# Altium schematic sheet FPOSINDC3.SchDoc
size A3; PageSetup: Record=PageOptions|CenterHorizontal=True|CenterVertical=True|PrintScale=0.73|XCorrection=1.00|YCorrection=1.00|PrintKind=1|BorderSize=5000000|LeftOffset=0|BottomOffset=0|Orientation=2|PaperLength=2970|PaperWidth=2100|Scale=100|PaperSource=256|PrintQuality=600|MediaType=0|DitherType=0|PaperKind=A4|PrintScaleMode=1
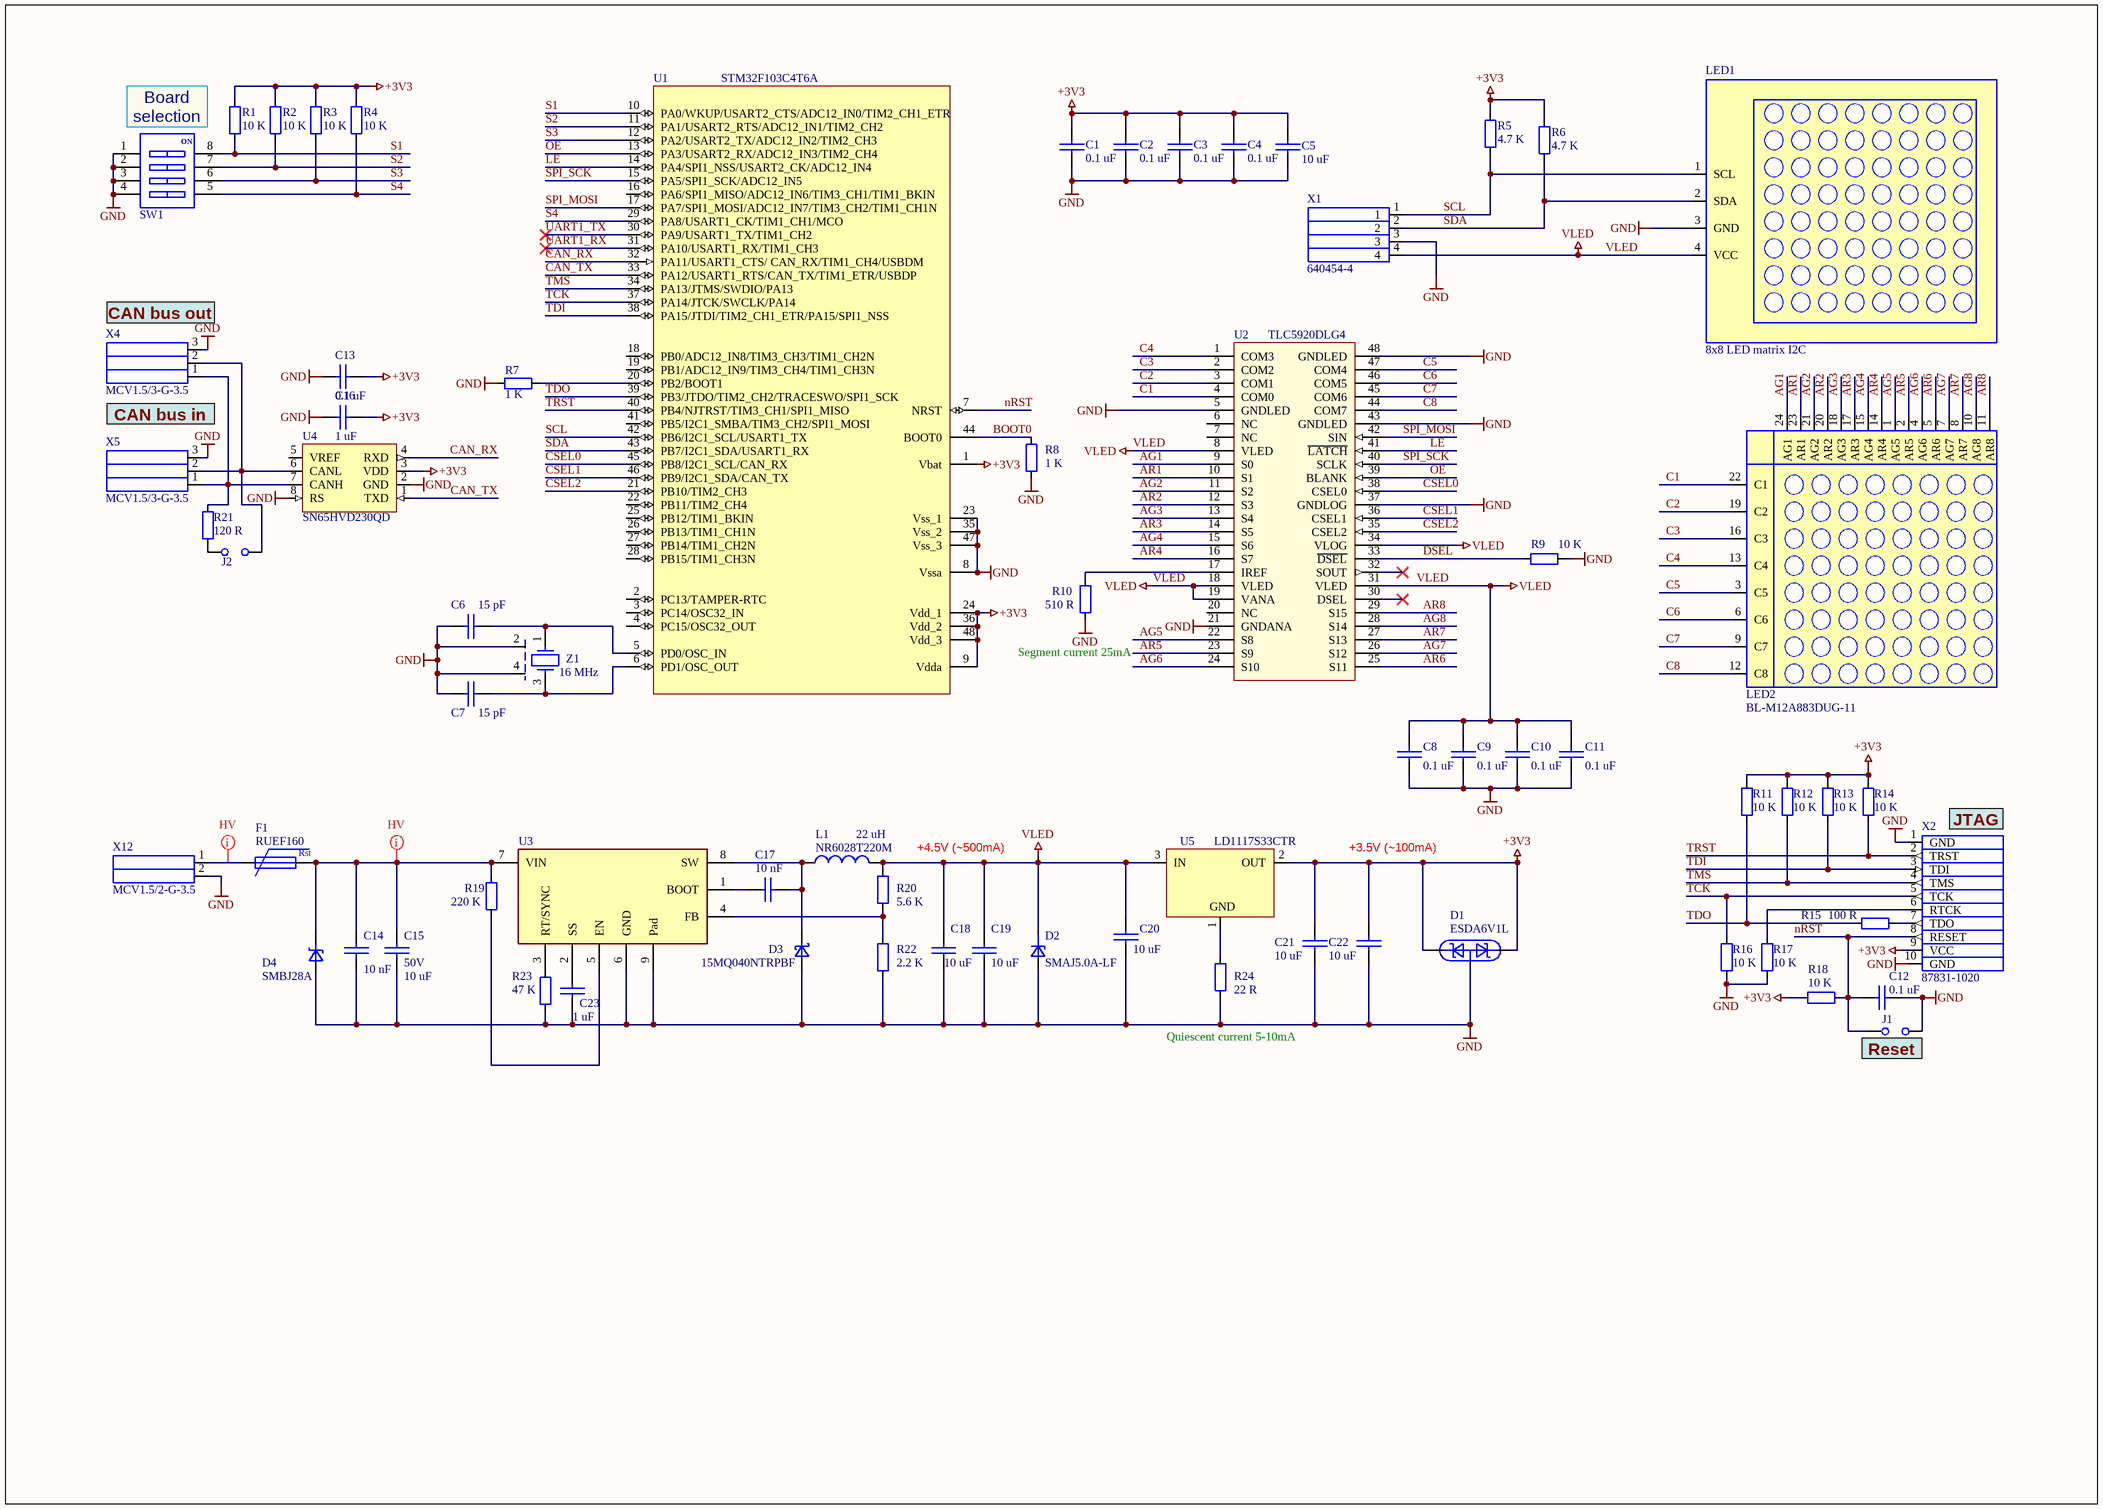
[diagram p0: FPOSINDC3.SchDoc]

## Parts
C1  value 0.1 uF  [1608[0603]]  (hidden comment: 0603B104K500CT)
C2  value 0.1 uF  [1608[0603]]  (hidden comment: 0603B104K500CT)
C3  value 0.1 uF  [1608[0603]]  (hidden comment: 0603B104K500CT)
C4  value 0.1 uF  [1608[0603]]  (hidden comment: 0603B104K500CT)
C5  value 10 uF  [2012[0805]]  (hidden comment: 08053D106KAT2A)
C6  value 15 pF  [1608[0603]]  (hidden comment: CCPF015K0603)
C7  value 15 pF  [1608[0603]]  (hidden comment: CCPF015K0603)
C8  value 0.1 uF  [1608[0603]]  (hidden comment: 0603B104K500CT)
C9  value 0.1 uF  [1608[0603]]  (hidden comment: 0603B104K500CT)
C10  value 0.1 uF  [1608[0603]]  (hidden comment: 0603B104K500CT)
C11  value 0.1 uF  [1608[0603]]  (hidden comment: 0603B104K500CT)
C12  value 0.1 uF  [1608[0603]]  (hidden comment: 0603B104K500CT)
C13  value 0.1 uF  [1608[0603]]  (hidden comment: 0603B104K500CT)
C14  value 10 nF  [1608[0603]]  (hidden comment: CL10B103KC8NNNC)
C15  value 10 uF  Voltage: 50V  [3225[1210]]  (hidden comment: GRM32DF51H106ZA01L)
C16  value 1 uF  [2012[0805]]  (hidden comment: C0805C105K5RACTU)
C17  value 10 nF  [1608[0603]]  (hidden comment: CL10B103KC8NNNC)
C18  value 10 uF  [2012[0805]]  (hidden comment: 08053D106KAT2A)
C19  value 10 uF  [2012[0805]]  (hidden comment: 08053D106KAT2A)
C20  value 10 uF  [2012[0805]]  (hidden comment: 08053D106KAT2A)
C21  value 10 uF  [2012[0805]]  (hidden comment: 08053D106KAT2A)
C22  value 10 uF  [2012[0805]]  (hidden comment: 08053D106KAT2A)
C23  value 1 uF  [2012[0805]]  (hidden comment: C0805C105K5RACTU)
D1  ESDA6V1L  [SOT23]
D2  SMAJ5.0A-LF  [DO-214AA_SMBJ]
D3  15MQ040NTRPBF  [SMA]
D4  SMBJ28A  [DO-214AA_SMBJ]
F1  RUEF160  [RUE160]
J1  Jumper  [HDR1X2V]  (value not drawn)
J2  Jumper  [HDR1X2V]  (value not drawn)
L1  NR6028T220M  value 22 uH  [NR6028 yuden]
LED1  8x8 LED matrix I2C  [I2C 8x8 matrix adafruit 902]  (graphical)
LED2  BL-M12A883DUG-11  [BL_M12A883DUG-11]
R1  value 10 K  [0603]  (hidden comment: RL0603K010-1)
R2  value 10 K  [0603]  (hidden comment: RL0603K010-1)
R3  value 10 K  [0603]  (hidden comment: RL0603K010-1)
R4  value 10 K  [0603]  (hidden comment: RL0603K010-1)
R5  value 4.7 K  [0603]  (hidden comment: RL0603K004.7-1)
R6  value 4.7 K  [0603]  (hidden comment: RL0603K004.7-1)
R7  value 1 K  [0603]  (hidden comment: RL0603K001-1)
R8  value 1 K  [0603]  (hidden comment: RL0603K001-1)
R9  value 10 K  [0603]  (hidden comment: RL0603K010-1)
R10  value 510 R  [0603]  (hidden comment: RL0603E510-1)
R11  value 10 K  [0603]  (hidden comment: RL0603K010-1)
R12  value 10 K  [0603]  (hidden comment: RL0603K010-1)
R13  value 10 K  [0603]  (hidden comment: RL0603K010-1)
R14  value 10 K  [0603]  (hidden comment: RL0603K010-1)
R15  value 100 R  [0603]  (hidden comment: RL0603E100-1)
R16  value 10 K  [0603]  (hidden comment: RL0603K010-1)
R17  value 10 K  [0603]  (hidden comment: RL0603K010-1)
R18  value 10 K  [0603]  (hidden comment: RL0603K010-1)
R19  value 220 K  [0603]  (hidden comment: RC0603FR-07220KL)
R20  5.6 K  [0603]
R21  value 120 R  [0603]  (hidden comment: RL0603E120-1)
R22  2.2 K  [0603]
R23  value 47 K  [0603]  (hidden comment: RC0603FR-0747KL)
R24  22 R  [0603]
SW1  MCDHN-04F-T-V  [MCDHN-04F-T-V]  (value not drawn)
U1  STM32F103C4T6A  [LQFP-48]
U2  TLC5920DLG4  [DL048]
U3  (no value)  [SOIC-8 EDP]
U4  SN65HVD230QD  [SO-8]
U5  LD1117S33CTR  [SOT-223]
X1  640454-4  [MTA-100 4-pos]
X2  87831-1020  [878311020 MGRID WALL HDR]
X4  MCV1.5/3-G-3.5  [mcv1.5-3-g_3.5]
X5  MCV1.5/3-G-3.5  [mcv1.5-3-g_3.5]
X12  MCV1.5/2-G-3.5  [mcv1.5-2-g_3.5]
Z1  value 16 MHz  [DSX321G]  (hidden comment: NX3225SA-16.0MHZ)

## Nets
+3V3: C1.2 C2.2 C3.2 C4.2 C5.2 C13.1 C16.1 C21.2 C22.2 D1.1 D1.2 R1.2 R2.2 R3.2 R4.2 R5.1 R6.1 R11.1 R12.1 R13.1 R14.1 R18.1 U1.1(Vbat) U1.9(Vdda) U1.24(Vdd_1) U1.36(Vdd_2) U1.48(Vdd_3) U4.3(VDD) U5.2(OUT) X2.9(VCC)
GND: C1.1 C2.1 C3.1 C4.1 C5.1 C6.2 C7.1 C8.1 C9.1 C10.1 C11.1 C12.2 C13.2 C14.2 C15.2 C16.2 C18.1 C19.1 C20.1 C21.1 C22.1 C23.1 D1.3 D2.2(A) D3.A D4.2(A) J1.2 LED1.3(GND) R7.1 R8.1 R9.2 R10.1 R16.2 R17.2 R22.1 R23.1 R24.1 SW1.1 SW1.2 SW1.3 SW1.4 U1.8(Vssa) U1.23(Vss_1) U1.35(Vss_2) U1.47(Vss_3) U2.5(GNDLED) U2.21(GNDANA) U2.37(GNDLOG) U2.43(GNDLED) U2.48(GNDLED) U3.6(GND) U3.9(Pad) U4.2(GND) U4.8(RS) X1.3 X2.1(GND) X2.10(GND) X4.3 X5.3 X12.2 Z1.2 Z1.4
VLED: C8.2 C9.2 C10.2 C11.2 C18.2 C19.2 C20.2 D2.1(C) L1.2 LED1.4(VCC) R20.2 U2.8(VLED) U2.18(VLED) U2.19(VANA) U2.31(VLED) U2.34(VLOG) U5.3(IN) X1.4
AG1: LED2.24(AG1) U2.9(S0)
AG2: LED2.21(AG2) U2.11(S2)
AG3: LED2.18(AG3) U2.13(S4)
AG4: LED2.15(AG4) U2.15(S6)
AG5: LED2.1(AG5) U2.22(S8)
AG6: LED2.4(AG6) U2.24(S10)
AG7: LED2.7(AG7) U2.26(S12)
AG8: LED2.10(AG8) U2.28(S14)
AR1: LED2.23(AR1) U2.10(S1)
AR2: LED2.20(AR2) U2.12(S3)
AR3: LED2.17(AR3) U2.14(S5)
AR4: LED2.14(AR4) U2.16(S7)
AR5: LED2.2(AR5) U2.23(S9)
AR6: LED2.5(AR6) U2.25(S11)
AR7: LED2.8(AR7) U2.27(S13)
AR8: LED2.11(AR8) U2.29(S15)
BOOT0: R8.2 U1.44(BOOT0)
C1: LED2.22(C1) U2.4(COM0)
C2: LED2.19(C2) U2.3(COM1)
C3: LED2.16(C3) U2.2(COM2)
C4: LED2.13(C4) U2.1(COM3)
C5: LED2.3(C5) U2.47(COM4)
C6: LED2.6(C6) U2.46(COM5)
C7: LED2.9(C7) U2.45(COM6)
C8: LED2.12(C8) U2.44(COM7)
CAN_RX: U1.32(PA11/USART1_CTS/_CAN_RX/TIM1_CH4/USBDM) U4.4(RXD)
CAN_TX: U1.33(PA12/USART1_RTS/CAN_TX/TIM1_ETR/USBDP) U4.1(TXD)
CSEL0: U1.45(PB8/I2C1_SCL/CAN_RX) U2.38(CSEL0)
CSEL1: U1.46(PB9/I2C1_SDA/CAN_TX) U2.36(CSEL1)
CSEL2: U1.21(PB10/TIM2_CH3) U2.35(CSEL2)
DSEL: R9.1 U2.33(~{DSEL})
LE: U1.14(PA4/SPI1_NSS/USART2_CK/ADC12_IN4) U2.41(~{LATCH})
nRST: C12.1 J1.1 R18.2 U1.7(NRST) X2.8(RESET)
OE: U1.13(PA3/USART2_RX/ADC12_IN3/TIM2_CH4) U2.39(BLANK)
S1: R1.1 SW1.8 U1.10(PA0/WKUP/USART2_CTS/ADC12_IN0/TIM2_CH1_ETR)
S2: R2.1 SW1.7 U1.11(PA1/USART2_RTS/ADC12_IN1/TIM2_CH2)
S3: R3.1 SW1.6 U1.12(PA2/USART2_TX/ADC12_IN2/TIM2_CH3)
S4: R4.1 SW1.5 U1.29(PA8/USART1_CK/TIM1_CH1/MCO)
SCL: LED1.1(SCL) R5.2 U1.42(PB6/I2C1_SCL/USART1_TX) X1.1
SDA: LED1.2(SDA) R6.2 U1.43(PB7/I2C1_SDA/USART1_RX) X1.2
SPI_MOSI: U1.17(PA7/SPI1_MOSI/ADC12_IN7/TIM3_CH2/TIM1_CH1N) U2.42(SIN)
SPI_SCK: U1.15(PA5/SPI1_SCK/ADC12_IN5) U2.40(SCLK)
TCK: R16.1 U1.37(PA14/JTCK/SWCLK/PA14) X2.5(TCK)
TDI: R13.2 U1.38(PA15/JTDI/TIM2_CH1_ETR/PA15/SPI1_NSS) X2.3(TDI)
TDO: R11.2 R15.1 U1.39(PB3/JTDO/TIM2_CH2/TRACESWO/SPI1_SCK)
TMS: R12.2 U1.34(PA13/JTMS/SWDIO/PA13) X2.4(TMS)
TRST: R14.2 U1.40(PB4/NJTRST/TIM3_CH1/SPI1_MISO) X2.2(TRST)
UART1_RX: U1.31(PA10/USART1_RX/TIM1_CH3)
UART1_TX: U1.30(PA9/USART1_TX/TIM1_CH2)
NetC6_1: C6.1 U1.5(PD0/OSC_IN) Z1.1
NetC7_2: C7.2 U1.6(PD1/OSC_OUT) Z1.3
NetC14_1: C14.1 C15.1 D4.1(C) F1.2 R19.2 U3.7(VIN)
NetC17_1: C17.1 D3.K L1.1 U3.8(SW)
NetC17_2: C17.2 U3.1(BOOT)
NetC23_2: C23.2 U3.2(SS)
NetF1_1: F1.1 X12.1
NetJ2_1: J2.1 U4.6(CANL) X4.2 X5.2
NetJ2_2: J2.2 R21.1
NetR7_2: R7.2 U1.20(PB2/BOOT1)
NetR10_2: R10.2 U2.17(IREF)
NetR15_2: R15.2 X2.7(TDO)
NetR17_1: R17.1 X2.6(RTCK)
NetR19_1: R19.1 U3.5(EN)
NetR20_1: R20.1 R22.2 U3.4(FB)
NetR21_2: R21.2 U4.7(CANH) X4.1 X5.1
NetR23_2: R23.2 U3.3(RT/SYNC)
NetR24_2: R24.2 U5.1(GND)

Not connected (* = marked no-connect by the designer): U1 2(PC13/TAMPER-RTC) 3(PC14/OSC32_IN) 4(PC15/OSC32_OUT) 16(PA6/SPI1_MISO/ADC12_IN6/TIM3_CH1/TIM1_BKIN) 18(PB0/ADC12_IN8/TIM3_CH3/TIM1_CH2N) 19(PB1/ADC12_IN9/TIM3_CH4/TIM1_CH3N) 22(PB11/TIM2_CH4) 25(PB12/TIM1_BKIN) 26(PB13/TIM1_CH1N) 27(PB14/TIM1_CH2N) 28(PB15/TIM1_CH3N) 41(PB5/I2C1_SMBA/TIM3_CH2/SPI1_MOSI); U2 6(NC) 7(NC) 20(NC) 30(DSEL)* 32(SOUT)*; U4 5(VREF)

## Layout directives
net class PowerVoltage: NetC14_1, NetF1_1

## Notes on the sheet
- Board selection
- (near X4) CAN bus out
- CAN bus in
- (near R10) Segment current 25mA
- +4.5V (~500mA)
- +3.5V (~100mA)
- (near X2) JTAG
- (near R24) Quiescent current 5-10mA
- (near J1) Reset
- (in symbol MCDHN-04F-T-V) ON
- (in symbol RUEF160) Rst

## Library data of the parts
C1-C4 C8-C13 = CVNF100K0603-25: 0.1 uF, 50V, 10% , X7R,  0603 SMD MLC Capacitor; Manufacturer: WALSIN; PartNum: 2496834; Tolerance: ± 10%; Distributor: Farnell; Price: 0.0062 Euro; Voltage: 50V; PartName: 0603B104K500CT
C5 = GRM21BR60J106KE19L: 10 uF, 25V, X5R, ±10%, 0805; Manufacturer: AVX Corporation; Distributor: TME; Price: 0.0593; Tolerance: ±10%; PartNum: 08053D106KAT2A; Voltage: 25V; PartName: 08053D106KAT2A
C6 C7 = CCPF015K0603: 15 pF, 50V, 5%, NP0, 0603 SMD MLC Capacitor; Manufacturer: Darfon; Tolerance: 5%; Price: 0.005 Euro; Distributor: Schukat; PartNum: CCPF015K0603; Voltage: 50 V; PartName: CCPF015K0603
C14 C17 = CVNF010K0603: 10 nF, 100V, 10%, X7R, 0603 SMD MLC Capacitor; Manufacturer: SAMSUNG; Tolerance: ±10%; Price: 0.00467; Distributor: TME; PartNum: CL10B103KC8NNNC; PartName: CL10B103KC8NNNC; Voltage: 100V
C15 = GRM32DF51H106ZA01L: 10uF, 50V, 20%, Y5V (F), 1210; Manufacturer: Murata Electronics North America; PartNum: 490-1891-1-ND; Tolerance: 20%; Price: 0.95$; Distributor: DigiKey; PartName: GRM32DF51H106ZA01L
C16 = CVUF001K0805: 1 uF, 50V, 10%, X7R, 0805; Manufacturer: KEMET; PartNum: 2118131RL; Tolerance: ± 10%; Price: 0.15; Distributor: Farnell; Voltage: 50V; PartName: C0805C105K5RACTU
C18-C22 = LMK212F106ZG-T: 10 uF, 25V, X5R, ±10%, 0805; Manufacturer: AVX Corporation; Distributor: TME; Price: 0.0593; Tolerance: ±10%; PartNum: 08053D106KAT2A; Voltage: 25V; PartName: 08053D106KAT2A
C23 = GRM21BR71A105KA01L: 1 uF, 50V, 10%, X7R, 0805; Manufacturer: KEMET; PartNum: 2118131RL; Tolerance: ± 10%; Price: 0.15; Distributor: Farnell; Voltage: 50V; PartName: C0805C105K5RACTU
D1 = ESDA6V1L: Dual transil array for ESD, 6.1 V, 300 W; Manufacturer: ST; PartNum: 511-ESDA6V1L; Distributor: Mouser; Price: 0.19$; PartName: ESDA6V1L
D2 = SMAJ5.0A-LF: TVS 400W 5.0V Unidirect; Manufacturer: LITTELFUSE; Distributor: TME; Price: 0.212; PartNum: SMAJ5.0A-LF; PartName: SMAJ5.0A-LF
D3 = 15MQ040N: Schottky Power Rectifier 3A, 40V, SMA; Manufacturer: VISHAY; Price: 0.13 Euro; Distributor: Digi-Key; PartNum: 15MQ040NTRPBF; PartName: 15MQ040NTRPBF
D4 = SMBJ28A: DIODE TVS 28V 600W UNI 5% SMD; Manufacturer: Littelfuse; PartNum: SMBJ28ABCT-ND; Distributor: DigiKey; Price: 0.18$; PartName: SMBJ28A; Value: 28 V
F1 = RUEF160: RUEF160 - POLYSWITCH, RADIAL, 1.6A; Manufacturer: RAYCHEM; PartNum: RUEF160-ND; Distributor: Digi-Key; Price: 0.33$; PartName: RUEF160
J1 J2 = Jumper: PartName: JUMPER-B; Manufacturer: NINIGI; Distributor: TME; PartNum: JUMPER-B
L1 = NR6028T220M: 22uH, 1.3 A, 0.175 Ohms, +-20%,- 25 C to + 120 C; Manufacturer: Taiyo Yuden; PartNum: 587-2103-1-ND; Tolerance: ±20%; Distributor: Digi-Key; Price: 0.39$; PartName: NR6028T220M
LED1 = 8x8 LED matrix I2C: Adafruit Bicolor LED Square Pixel Matrix with I2C Backpack; PartNum: ID: 902; Distributor: Farnell, adafru.it/902; Manufacturer: Adafruit; Price: 15.95$
LED2 = BL-M12A883DUG-11: DOTMATRIX DISPLAY row catode red/green 8x8 31.7x31.7mm; Imax 30mA; Manufacturer: BetLuxs; Distributor: Farnell, adafru.it/458; Price: 30.56; PartNum: BL-M12A883DUG-11; PartName: BL-M12A883DUG-11
R1-R4 R9 R11-R14 R16-R18 = RL0603K010-1: 10 K, 1%, 0603, SMD Resistor, Taped; Manufacturer: YAGEO; PartNum: 1500585; PartName: RT0603FRE0710KL; Voltage: 75V; Distributor: Farnell; Price: 0.002 Euro; Tolerance: ± 1%
R5 R6 = RL0603K004.7-1: 4.7 K, 1%, 0603, SMD Resistor, Taped; Manufacturer: Vishay; Voltage: 75 V; Distributor: Schukat; Price: 0.002 Euro; Tolerance: 1%; PartNum: RL0603K004.7-1; PartName: 4.7 K, 1%, 0603, SMD Resistor
R7 R8 = RL0603K001-1: 1 K, 1%, 0603, SMD Resistor, Taped; Manufacturer: Vishay; Voltage: 75 V; Distributor: Farnell; Price: 0.002 Euro; Tolerance: 1%; PartNum: RL0603K001-1; PartName: RL0603K001-1
R10 = RL0603E510-1: 510 R, 1%, 0603, SMD Resistor, Taped; Manufacturer: Vishay; Voltage: 75 V; Distributor: Schukat; Price: 0.002 Euro; Tolerance: 1%; PartNum: RL0603E510-1; PartName: 510 R, 1%, 0603, SMD Resistor
R15 = RL0603E100-1: 100 R, 1%, 0603, SMD Resistor, Taped; Manufacturer: Vishay; Voltage: 75 V; Distributor: Farnell; Price: 0.002 Euro; Tolerance: 1%; PartNum: RL0603E100-1; PartName: RL0603E100-1
R19 = RL0603K220-1_1: 220 K, 1%, 0603, SMD Resistor, Taped; Manufacturer: YAGEO AMERICA CORPORATION; Voltage: 75 V; Distributor: Future; Price: 0.0017$; Tolerance: 1%; PartNum: RC0603FR-07220KL; PartName: RC0603FR-07220KL
R20 = RL0603K005.6-1: 5.6 K, 1%, 0603, SMD Resistor, Taped; Manufacturer: Vishay; Voltage: 75 V; Distributor: Schukat; Price: 0.002 Euro; Tolerance: 1%; PartNum: RL0603K005.6-1; PartName: 5.6 K, 1%, 0603, SMD Resistor,; Value: 5.6 K
R21 = RL0603E120-1: 120 R, 1%, 0603, SMD Resistor, Taped; Manufacturer: Vishay; Voltage: 75 V; Distributor: Farnell; Price: 0.002 Euro; Tolerance: 1%; PartNum: RL0603E120-1; PartName: RL0603E120-1
R22 = RL0603K002.2-1: 2.2 K, 1%, 0603, SMD Resistor, Taped; Manufacturer: Vishay; Voltage: 75 V; Distributor: Schukat; Price: 0.002 Euro; Tolerance: 1%; PartNum: RL0603K002.2-1; PartName: 2.2 K, 1%, 0603, SMD Resistor; Value: 2.2 K
R23 = RC0603FR-0747KL: 47 K, 1%, 0603, SMD Resistor, Taped; Manufacturer: YAGEO AMERICA CORPORATION; Voltage: 75 V; Distributor: Future; Price: 0.002 Euro; Tolerance: 1%; PartNum: RC0603FR-0747KL; PartName: RC0603FR-0747KL
R24 = RL0603E022-1: 22 R, 1%, 0603, SMD Resistor, Taped; Manufacturer: Vishay; Voltage: 75 V; Distributor: Schukat; Price: 0.002 Euro; Tolerance: 1%; Value: 22 R; PartNum: RL0603E022-1; PartName: 22 R, 1%, 0603, SMD
SW1 = MCDHN-04F-T-V: SWITCH, DIP, SMD, 4 WAY, 1.27mm; Manufacturer: MULTICOMP; PartNum: 1605479; Distributor: Farnell; Price: 0.69 Euro; PartName: MCDHN-04F-T-V
U1 = STM32F103C4T6A: MCU ARM 32BIT 16K FLASH 48-LQFP; Manufacturer: STMicroelectronics; PartNum: 497-8316-ND; Distributor: DigiKey; Price: 4.81$; PartName: STM32F103C4T6A
U2 = TLC5920DLG4: 16X8BIT LED DRIVER/CONTRLR, SSOP48; Manufacturer: TI; PartNum: 1226302; Distributor: Farnell; Price: 6.2; PartName: TLC5920DLG4
U3 = LM22672MR-ADJ: SIMPLESWITCH, 1.0A 4.5~42VIN, 8PSOP, Vf 1.285; Manufacturer: TI; PartNum: 2323524; PartName: LM22672MR-ADJ/NOPB; Price: 11.16; Distributor: Farnell
U4 = SN65HVD230QD: 3.3-V CAN TRANSCEIVERS SO-8; Manufacturer: Texas Instruments; PartNum: 296-13123-5-ND; Price: 4.3$; Distributor: Digi-Key; PartName: SN65HVD230QD
U5 = LD1117S33CTR: Low drop positive voltage regulator, 3.3 V, 1A, SOT-223; Manufacturer: STMicroelectronics; PartNum: 497-1241-1-ND; Distributor: Digi-Key; Price: 0.59$; PartName: LD1117S33CTR
X1 = 640454-4: CONN HEADER VERT 4POS .100 TIN; Manufacturer: TE Connectivity; PartNum: A19431-ND; Distributor: Digi-Key; Price: 0.14$; PartName: 640454-4
X2 = 87831-1020: JTAG 2*5 2mm; Manufacturer: Molex/Waldom Electronics Corp; PartNum: WM18560-ND; Distributor: Digi-Key; Price: 0.79$; PartName: 87831-1020
X4 X5 = MCV1.5/3-G-3.5: HEADER, VERTICAL, 3.5MM, 3WAY; Manufacturer: PHOENIX CONTACT; PartNum: 3704828; PartName: 1843619; Distributor: Farnell; Price: 1.77
X12 = MCV1.5/2-G-3.5: HEADER, VERTICAL, 3.5MM, 2WAY; Manufacturer: PHOENIX CONTACT; PartNum: 3704816; PartName: 1843606; Distributor: Farnell; Price: 1.02
Z1 = NX3225SA-16.0MHZ: 16 MHz, 8 pF, +-15 ppm, -10..+75 С; Manufacturer: NDK; PartNum: 644-1049-1-ND; Tolerance: 15 ppm; Price: 1$; Distributor: DigiKey; PartName: NX3225SA-16.0MHZ